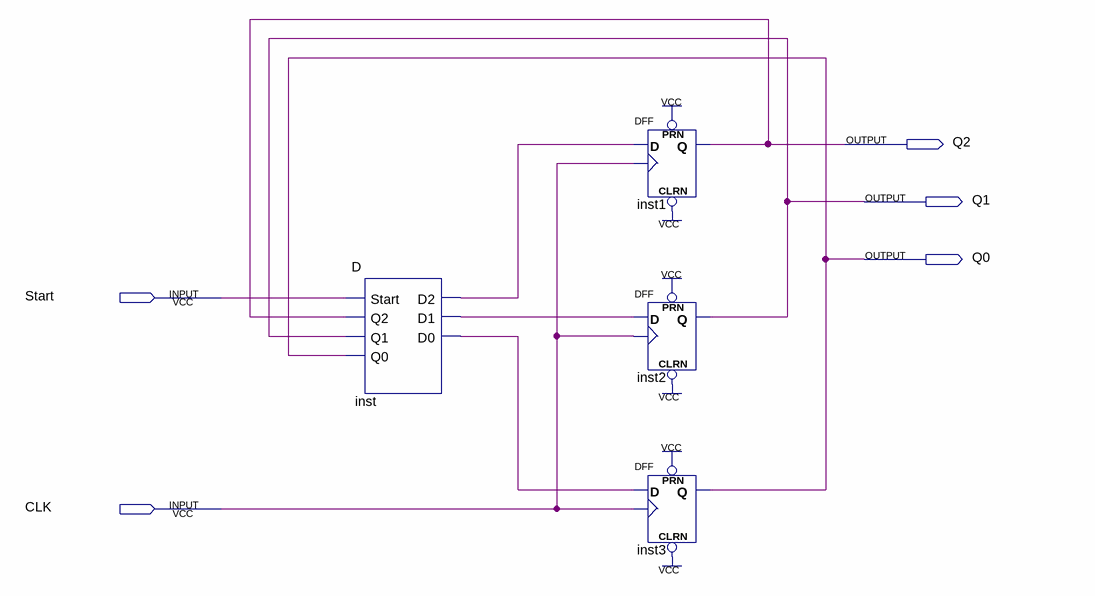
[diagram p0: schematic sheet]
// Quartus schematic FSM.bdf as structural Verilog: 4 symbols, 5 pins
module FSM (
  input  Start,
  input  CLK,
  output Q2,
  output Q1,
  output Q0
);

  wire inst_d0, inst_d1, inst_d2;

  D inst (.Start(Start), .Q2(Q2), .Q1(Q1), .Q0(Q0), .D2(inst_d2), .D1(inst_d1), .D0(inst_d0));
  DFF inst1 (.CLRN(1'b1), .CLK(CLK), .D(inst_d2), .PRN(1'b1), .Q(Q2));
  DFF inst2 (.CLRN(1'b1), .CLK(CLK), .D(inst_d1), .PRN(1'b1), .Q(Q1));
  DFF inst3 (.CLRN(1'b1), .CLK(CLK), .D(inst_d0), .PRN(1'b1), .Q(Q0));
endmodule
